# EAGLE design V2d_PCB (EAGLE 6.5.0)
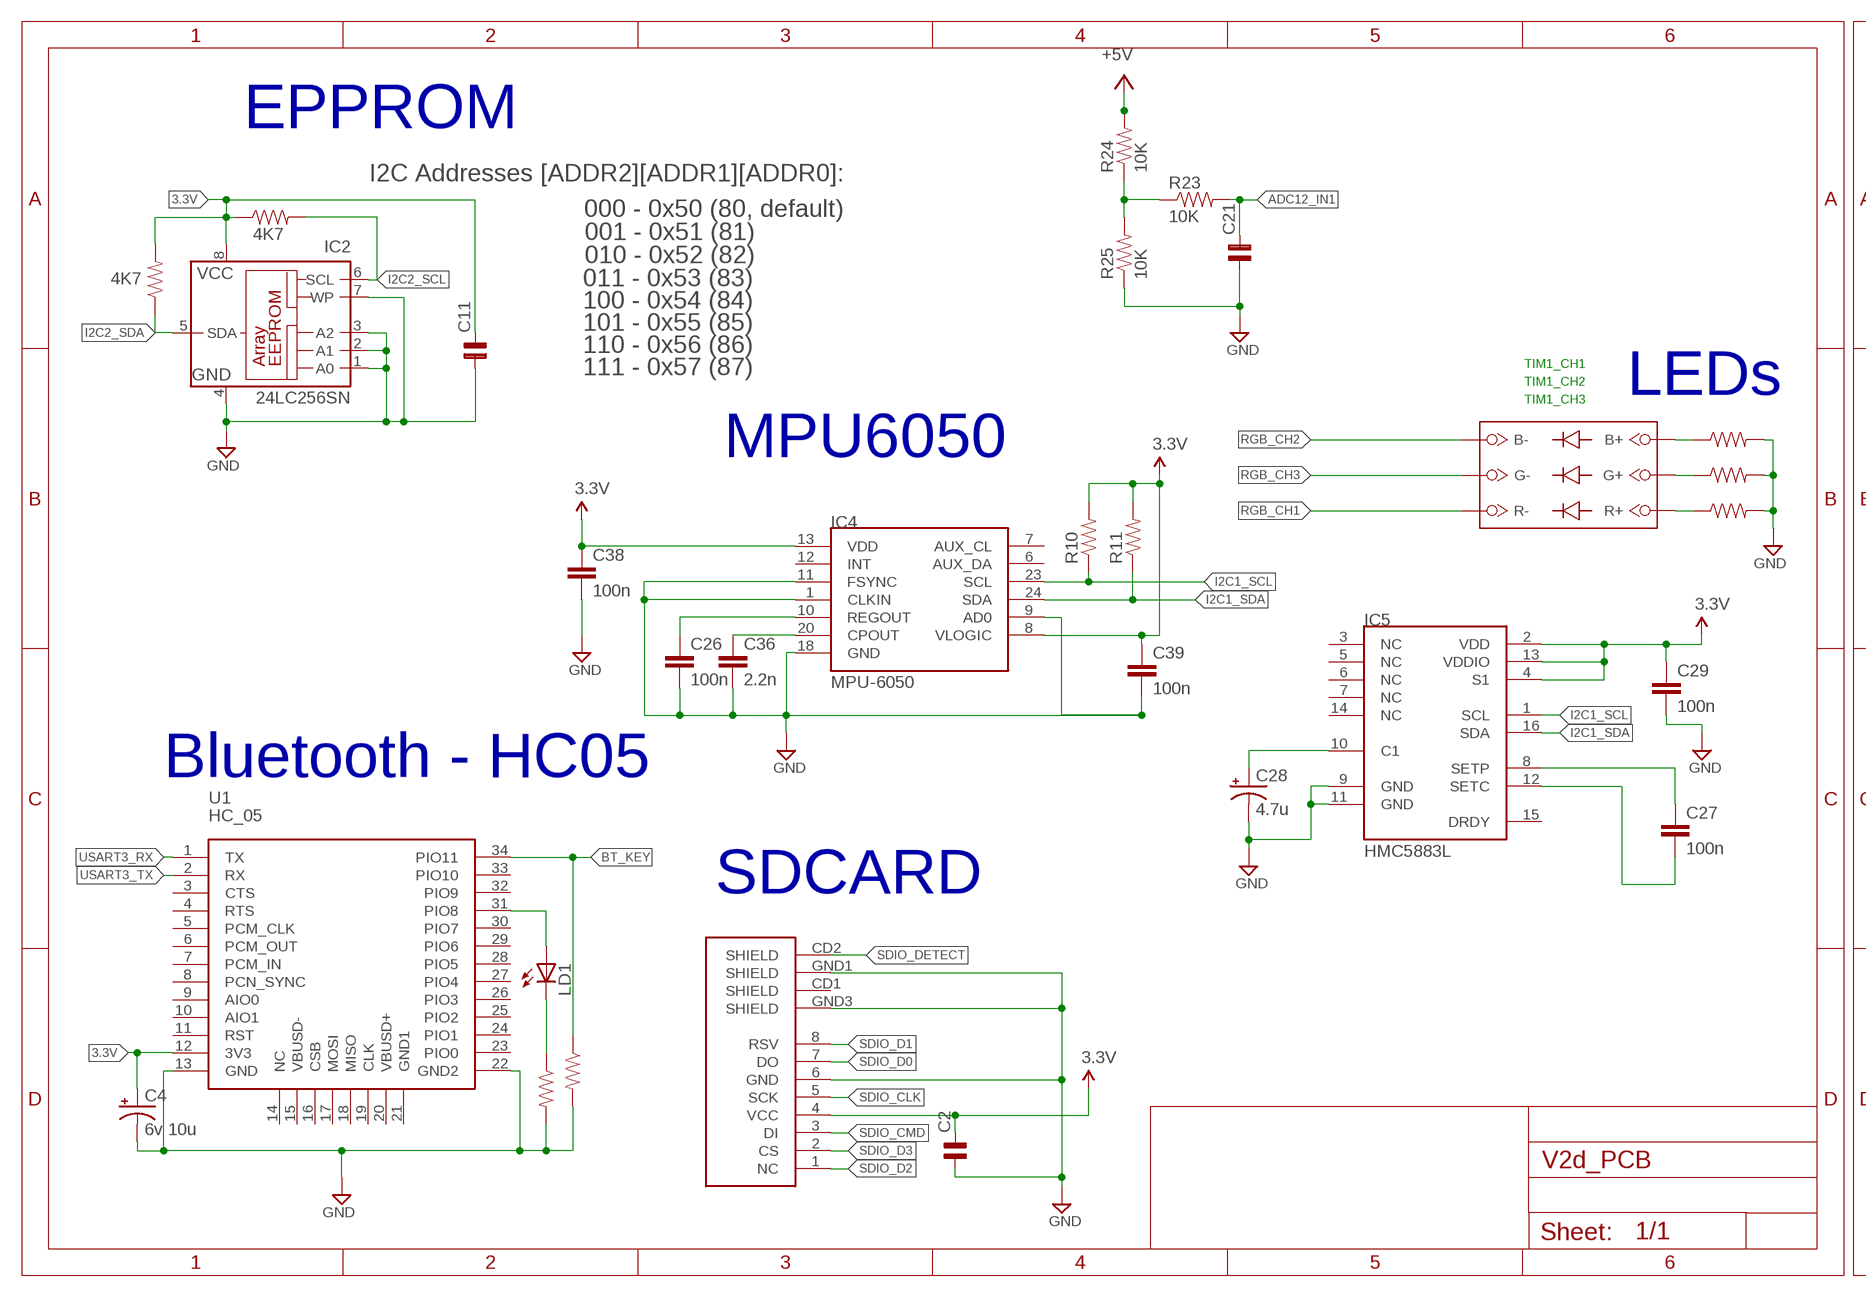
[diagram p0: schematic, sheet 1, part 1 of 2]
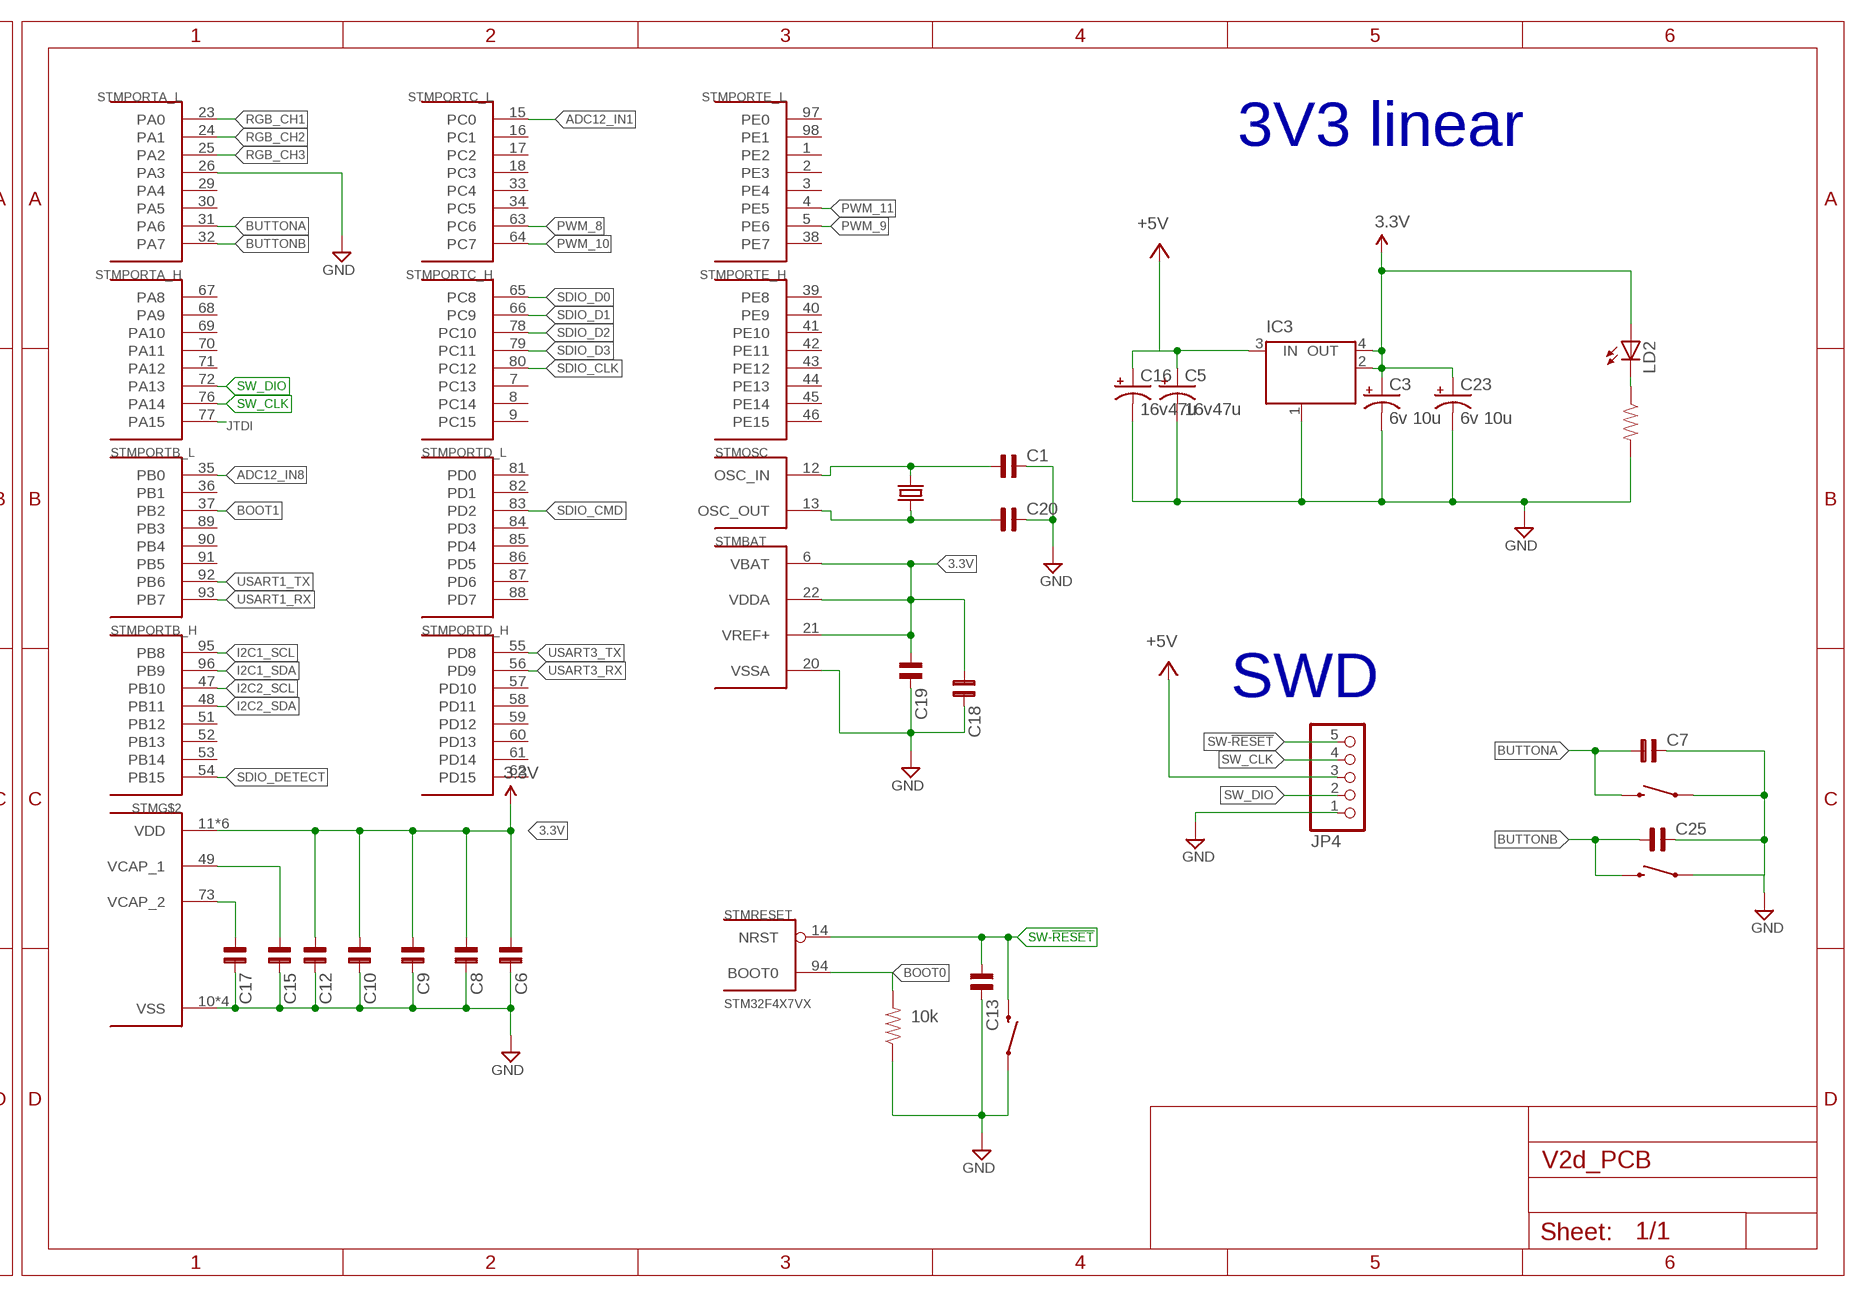
[diagram p1: schematic, sheet 1, part 2 of 2]

## Parts
C1  C-NP-SMD-0603  [C-0603]
C2  C-NP-SMD-0603  [C-0603]
C3  6v 10u  CPOL-USSMCC  [SMC_C]
C4  6v 10u  CPOL-USSMCA  [SMC_A]
C5  16v47u  CPOL-USSMCC  [SMC_C]
C6  C-NP-SMD-0603  [C-0603]
C7  C-NP-SMD-0603  [C-0603]
C8  C-NP-SMD-0603  [C-0603]
C9  C-NP-SMD-0603  [C-0603]
C10  C-NP-SMD-0603  [C-0603]
C11  C-NP-SMD-0603  [C-0603]
C12  C-NP-SMD-0603  [C-0603]
C13  C-NP-SMD-0603  [C-0603]
C15  C-NP-SMD-0603  [C-0603]
C16  16v47u  CPOL-USSMCC  [SMC_C]
C17  C-NP-SMD-0603  [C-0603]
C18  C-NP-SMD-0603  [C-0603]
C19  C-NP-SMD-0603  [C-0603]
C20  C-NP-SMD-0603  [C-0603]
C21  C-NP-SMD-0603  [C-0603]
C23  6v 10u  CPOL-USSMCC  [SMC_C]
C25  C-NP-SMD-0603  [C-0603]
C26  100n  SPARKFUN_CAP0603-CAP  [SPARKFUN_0603-CAP]
C27  100n  SPARKFUN_CAP0603-CAP  [SPARKFUN_0603-CAP]
C28  4.7u  CPOL-USSMCA  [SMC_A]
C29  100n  SPARKFUN_CAP0603-CAP  [SPARKFUN_0603-CAP]
C36  2.2n  SPARKFUN_CAP0603-CAP  [SPARKFUN_0603-CAP]
C38  100n  SPARKFUN_CAP0603-CAP  [SPARKFUN_0603-CAP]
C39  100n  SPARKFUN_CAP0603-CAP  [SPARKFUN_0603-CAP]
IC2  24LC256SN  [SO-08]
IC3  LINEAR_MC33269ST-3.3T3  [LINEAR_SOT223]
IC4  MPU-6050  TESTING_MPU-6050-1  [TESTING_QFN-24-4MM2]
IC5  HMC5883L  SPARKFUN_HMC5883LSMD  [SPARKFUN_16LPCC]
JP4  PINHD-1X5_2.54-90°  [1X05/90]
LD1  LEDCHIPLED_0603  [CHIPLED_0603]
LD2  LEDCHIPLED_0603  [CHIPLED_0603]
R1  10K  SPARKFUN_RESISTOR0603-RES  [SPARKFUN_0603-RES]
R2  10K  SPARKFUN_RESISTOR0603-RES  [SPARKFUN_0603-RES]
R3  10K  SPARKFUN_RESISTOR0603-RES  [SPARKFUN_0603-RES]
R5  10K  SPARKFUN_RESISTOR0603-RES  [SPARKFUN_0603-RES]
R6  10K  SPARKFUN_RESISTOR0603-RES  [SPARKFUN_0603-RES]
R7  10k  SPARKFUN_RESISTOR0603-RES  [SPARKFUN_0603-RES]
R9  10K  SPARKFUN_RESISTOR0603-RES  [SPARKFUN_0603-RES]
R10  SPARKFUN_RESISTOR0603-RES  [SPARKFUN_0603-RES]
R11  SPARKFUN_RESISTOR0603-RES  [SPARKFUN_0603-RES]
R15  4K7  SPARKFUN_RESISTOR0603-RES  [SPARKFUN_0603-RES]
R16  4K7  SPARKFUN_RESISTOR0603-RES  [SPARKFUN_0603-RES]
R23  10K  SPARKFUN_RESISTOR0603-RES  [SPARKFUN_0603-RES]
R24  10K  SPARKFUN_RESISTOR0603-RES  [SPARKFUN_0603-RES]
R25  10K  SPARKFUN_RESISTOR0603-RES  [SPARKFUN_0603-RES]
S1  RESET  SWITCH-MOMENTARY-2-SMD-1101NE  [TACTILE-SWITCH-1101NE]
S2  RESET  SWITCH-MOMENTARY-2-SMD-1101NE  [TACTILE-SWITCH-1101NE]
S4  RESET  SWITCH-MOMENTARY-2-SMD-1101NE  [TACTILE-SWITCH-1101NE]
SDCARD2  microSD Socket  USD-SOCKETNEW  [MICRO-SD-SOCKET-PP]
STM  STM32F4X7VX  [TQFP100]
U1  HC_05  [BLUETOOTH_SMD]
U$12  RGB_LED  [SMD]
Y1  CRYSTALHC49US  [HC49US]

## Nets
3.3V: C2.2 C3.+ C4.+ C6.1 C8.1 C9.1 C10.1 C11.2 C12.1 C18.1 C19.1 C23.+ C29.1 C38.1 C39.1 IC2.8(VCC) IC3.2(OUT) IC3.4(OUT) IC4.8(VLOGIC) IC4.13(VDD) IC5.2(VDD) IC5.4(S1) IC5.13(VDDIO) LD2.A R10.2 R11.2 R15.1 R16.2 SDCARD2.4(VCC) STM.6(BAT:VBAT) STM.11(VDD) STM.19(VDD) STM.21(BAT:VREF+) STM.22(BAT:VDDA) STM.28(VDD) STM.50(VDD) STM.75(VDD) STM.100(VDD) U1.12(3V3)
+5V: C5.+ C16.+ IC3.3(IN) JP4.3 R24.2
ADC12_IN1: C21.2 R23.2 STM.15(PORTC_L:PC0)
ADC12_IN8: STM.35(PORTB_L:PB0)
BOOT0: R7.2 STM.94(RESET:BOOT0)
BOOT1: STM.37(PORTB_L:PB2)
BT_KEY: R5.1 U1.34(PIO11)
BUTTONA: C7.1 S4.P$2 STM.31(PORTA_L:PA6)
BUTTONB: C25.1 S2.P$2 STM.32(PORTA_L:PA7)
GND: C1.2 C2.1 C3.- C4.- C5.- C6.2 C7.2 C8.2 C9.2 C10.2 C11.1 C12.2 C13.2 C15.2 C16.- C17.2 C18.2 C19.2 C20.2 C21.1 C23.- C25.2 C26.2 C28.- C29.2 C36.2 C38.2 C39.2 IC2.1(A0) IC2.2(A1) IC2.3(A2) IC2.4(GND) IC2.7(WP) IC3.1(GND/ADJ) IC4.1(CLKIN) IC4.9(AD0) IC4.11(FSYNC) IC4.18(GND) IC5.9(GND) IC5.11(GND) JP4.1 R1.2 R2.2 R3.2 R5.2 R6.2 R7.1 R9.2 R25.1 S1.P$1 S2.P$1 S4.P$1 SDCARD2.6(GND) SDCARD2.GND1(SHIELD) SDCARD2.GND3(SHIELD) STM.10(VSS) STM.20(BAT:VSSA) STM.26(PORTA_L:PA3) STM.27(VSS) STM.74(VSS) STM.99(VSS) U1.13(GND) U1.22(GND2)
I2C1_SCL: IC4.23(SCL) IC5.1(SCL) R10.1 STM.95(PORTB_H:PB8)
I2C1_SDA: IC4.24(SDA) IC5.16(SDA) R11.1 STM.96(PORTB_H:PB9)
I2C2_SCL: IC2.6(SCL) R15.2 STM.47(PORTB_H:PB10)
I2C2_SDA: IC2.5(SDA) R16.1 STM.48(PORTB_H:PB11)
JTDI: STM.77(PORTA_H:PA15)
N$1: C1.1 STM.12(OSC:OSC_IN) Y1.2
N$2: R2.1 U$12.B+
N$3: C26.1 IC4.10(REGOUT)
N$4: LD1.A U1.31(PIO8)
N$5: LD1.C R9.1
N$6: R6.1 U$12.R+
N$7: R3.1 U$12.G+
N$8: C36.1 IC4.20(CPOUT)
N$10: C27.1 IC5.8(SETP)
N$11: LD2.C R1.1
N$12: C28.+ IC5.10(C1)
N$13: C27.2 IC5.12(SETC)
N$27: R23.1 R24.1 R25.2
N$29: C20.1 STM.13(OSC:OSC_OUT) Y1.1
N$31: C17.1 STM.73(VCAP_2)
N$32: C15.1 STM.49(VCAP_1)
PWM_8: STM.63(PORTC_L:PC6)
PWM_9: STM.5(PORTE_L:PE6)
PWM_10: STM.64(PORTC_L:PC7)
PWM_11: STM.4(PORTE_L:PE5)
RGB_CH1: STM.23(PORTA_L:PA0) U$12.R-
RGB_CH2: STM.24(PORTA_L:PA1) U$12.B-
RGB_CH3: STM.25(PORTA_L:PA2) U$12.G-
SDIO_CLK: SDCARD2.5(SCK) STM.80(PORTC_H:PC12)
SDIO_CMD: SDCARD2.3(DI) STM.83(PORTD_L:PD2)
SDIO_D0: SDCARD2.7(DO) STM.65(PORTC_H:PC8)
SDIO_D1: SDCARD2.8(RSV) STM.66(PORTC_H:PC9)
SDIO_D2: SDCARD2.1(NC) STM.78(PORTC_H:PC10)
SDIO_D3: SDCARD2.2(CS) STM.79(PORTC_H:PC11)
SDIO_DETECT: SDCARD2.CD2(SHIELD) STM.54(PORTB_H:PB15)
SW-!RESET: C13.1 JP4.5 S1.P$2 STM.14(RESET:NRST)
SW_CLK: JP4.4 STM.76(PORTA_H:PA14)
SW_DIO: JP4.2 STM.72(PORTA_H:PA13)
USART1_RX: STM.93(PORTB_L:PB7)
USART1_TX: STM.92(PORTB_L:PB6)
USART3_RX: STM.56(PORTD_H:PD9) U1.1(TX)
USART3_TX: STM.55(PORTD_H:PD8) U1.2(RX)
Unconnected: IC4.6(AUX_DA) IC4.7(AUX_CL) IC4.12(INT) IC5.3(NC) IC5.5(NC) IC5.6(NC) IC5.7(NC) IC5.14(NC) IC5.15(DRDY) SDCARD2.CD1(SHIELD) STM.1(PORTE_L:PE2) STM.2(PORTE_L:PE3) STM.3(PORTE_L:PE4) STM.7(PORTC_H:PC13) STM.8(PORTC_H:PC14) STM.9(PORTC_H:PC15) STM.16(PORTC_L:PC1) STM.17(PORTC_L:PC2) STM.18(PORTC_L:PC3) STM.29(PORTA_L:PA4) STM.30(PORTA_L:PA5) STM.33(PORTC_L:PC4) STM.34(PORTC_L:PC5) STM.36(PORTB_L:PB1) STM.38(PORTE_L:PE7) STM.39(PORTE_H:PE8) STM.40(PORTE_H:PE9) STM.41(PORTE_H:PE10) STM.42(PORTE_H:PE11) STM.43(PORTE_H:PE12) STM.44(PORTE_H:PE13) STM.45(PORTE_H:PE14) STM.46(PORTE_H:PE15) STM.51(PORTB_H:PB12) STM.52(PORTB_H:PB13) STM.53(PORTB_H:PB14) STM.57(PORTD_H:PD10) STM.58(PORTD_H:PD11) STM.59(PORTD_H:PD12) STM.60(PORTD_H:PD13) STM.61(PORTD_H:PD14) STM.62(PORTD_H:PD15) STM.67(PORTA_H:PA8) STM.68(PORTA_H:PA9) STM.69(PORTA_H:PA10) STM.70(PORTA_H:PA11) STM.71(PORTA_H:PA12) STM.81(PORTD_L:PD0) STM.82(PORTD_L:PD1) STM.84(PORTD_L:PD3) STM.85(PORTD_L:PD4) STM.86(PORTD_L:PD5) STM.87(PORTD_L:PD6) STM.88(PORTD_L:PD7) STM.89(PORTB_L:PB3) STM.90(PORTB_L:PB4) STM.91(PORTB_L:PB5) STM.97(PORTE_L:PE0) STM.98(PORTE_L:PE1) U1.3(CTS) U1.4(RTS) U1.5(PCM_CLK) U1.6(PCM_OUT) U1.7(PCM_IN) U1.8(PCN_SYNC) U1.9(AIO0) U1.10(AIO1) U1.11(RST) U1.14(NC) U1.15(VBUSD-) U1.16(CSB) U1.17(MOSI) U1.18(MISO) U1.19(CLK) U1.20(VBUSD+) U1.21(GND1) U1.23(PIO0) U1.24(PIO1) U1.25(PIO2) U1.26(PIO3) U1.27(PIO4) U1.28(PIO5) U1.29(PIO6) U1.30(PIO7) U1.32(PIO9) U1.33(PIO10)

## Notes on the sheet
- EPPROM | 3V3 linear
- I2C Addresses [ADDR2][ADDR1][ADDR0]:
- 000 - 0x50 (80, default)
- 001 - 0x51 (81)
- 010 - 0x52 (82)
- 011 - 0x53 (83)
- 100 - 0x54 (84)
- 101 - 0x55 (85)
- 110 - 0x56 (86)
- TIM1_CH1
- 111 - 0x57 (87)
- TIM1_CH2
- LEDs
- TIM1_CH3
- MPU6050
- SWD
- Bluetooth - HC05
- SDCARD
- TJA1040

## Library data of the parts
C1 C2 C6-C13 C15 C17-C21 C25 = cap-pan40:C-NP: NON-POLARIZED FILM/CHIP
C3-C5 C16 C23 C28 = rcl:CPOL-US: POLARIZED CAPACITOR, American symbol
C26 C27 C29 C36 C38 C39 = Helios_RLC:SPARKFUN_CAP: Capacitor Standard 0603 ceramic capacitor, and 0.1" leaded capacitor.
IC2 = microchip:24*: Serial EEPROM I2C; DIGIKEY: 24LC256-E/SN-ND; MF: MICROCHIP; MPN: 24LC256-I/SN; OC_FARNELL: 9757996; OC_NEWARK: 27C9144
IC3 = Robotech_Other:LINEAR_MC33269ST*: Adjustable Output Low Dropout Voltage Regulator 800 mA Source: http://www.onsemi.com/pub/Collateral/MC33269-D.PDF
IC4 = Helios_IMU:TESTING_MPU-6050
IC5 = Helios_IMU:SPARKFUN_HMC5883L: 3 Axis Digital Compass IC
JP4 = pinhead-1:PINHD-1X5: PIN HEADER
LD1 LD2 = led:LED: LED OSRAM: - CHIPLED LG R971, LG N971, LY N971, LG Q971, LY Q971, LO R971, LY R971 LH N974, LH R974 LS Q976, LO Q976, LY Q976 LO Q996 - Hyper CHIPLED LW Q18S LB Q993, LB Q99A, LB R99A - SideLED LS A670, LO A670, LY A670, LG A670, LP A670 LB A673, LV A673, LT A673, LW A673 LH A674 LY A675 LS A676, LA A676, LO A676, LY A676, LW A676 LS A679, LY A679, LG A679 - Hyper Micro SIDELED® LS Y876, LA Y876, LO Y876, LY Y876 LT Y87S - SmartLED LW L88C, LW L88S LB L89C, LB L89S, LG L890 LS L89K, LO L89K, LY L89K LS L896, LA L896, LO L896, LY L896 - TOPLED LS T670, LO T670, LY T670, LG T670, LP T670 LSG T670, LSP T670, LSY T670, LOP T670, LYG T670 LG T671, LOG T671, LSG T671 LB T673, LV T673, LT T673, LW T673 LH T674 LS T676, LA T676, LO T676, LY T676, LB T676, LH T676, LSB T676, LW T676 LB T67C, LV T67C, LT T67C, LS T67K, LO T67K, LY T67K, LW E67C LS E67B, LA E67B, LO E67B, LY E67B, LB E67C, LV E67C, LT E67C LW T67C LS T679, LY T679, LG T679 LS T770, LO T770, LY T770, LG T770, LP T770 LB T773, LV T773, LT T773, LW T773 LH T774 LS E675, LA E675, LY E675, LS T675 LS T776, LA T776, LO T776, LY T776, LB T776 LHGB T686 LT T68C, LB T68C - Hyper Mini TOPLED® LB M676 - Mini TOPLED Santana® LG M470 LS M47K, LO M47K, LY M47K Source: http://www.osram.convergy.de/
R1-R3 R5-R7 R9 R15 R16 R23-R25 = Robotech_RCL:SPARKFUN_RESISTOR: Resistor Basic schematic elements and footprints for 0603, 1206, and PTH resistors.
R10 R11 = Helios_RLC:SPARKFUN_RESISTOR: Resistor Basic schematic elements and footprints for 0603, 1206, and PTH resistors.
S1 S2 S4 = pixhawk2:SWITCH-MOMENTARY-2; PARTNO: EVQ-P7J01P
SDCARD2 = SparkFun:USD-SOCKET: microSD Socket Push-push type uSD socket. Schematic element and footprint production proven. Spark Fun Electronics SKU : PRT-00127. tDoc lines correctly indicate media card edge positions when inserting (unlocked, locked, depressed).
STM = pixhawk2:STM32F4X7VX: STM32F4X7VX 100 pin LQFP STM32F407VE - 512 KB flash, no crypto STM32F407VG - 1 MB flash, no crypto STM32F417VE - 512 KB flash, with crypto STM32F417VG - 1 MB flash, with crypto; PARTNO: STM32F427VI
U1 = SerialPortBluetooth:HC_05
U$12 = RGB_LED:RGB_LED
Y1 = SparkFun-FreqCtrl:CRYSTAL: Various standard crystals. Proven footprints. Spark Fun Electronics SKU : COM-00534

## Net classes
1 power: width 0.15 mm, drill 0.2 mm, clearance 0.152 mm

## Board
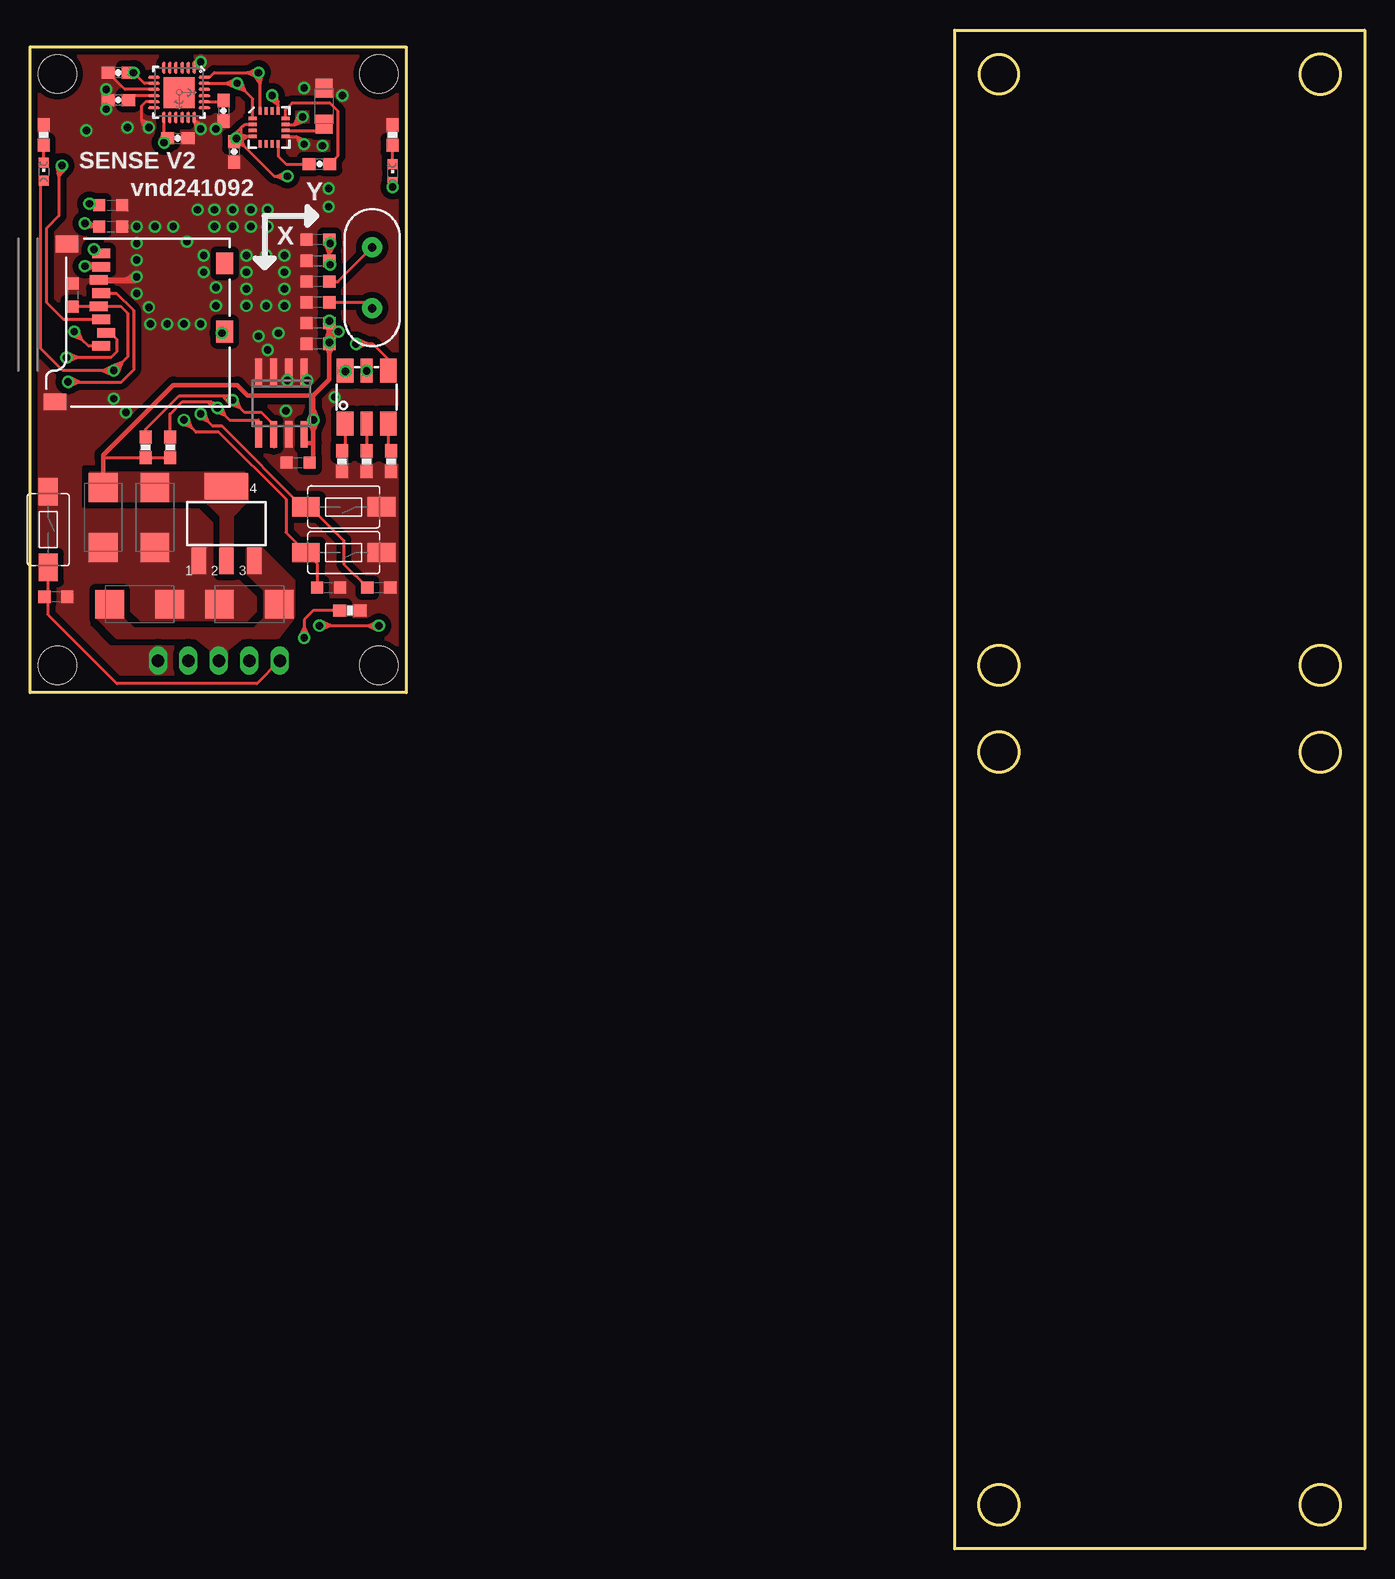
[diagram p2: board, top side]
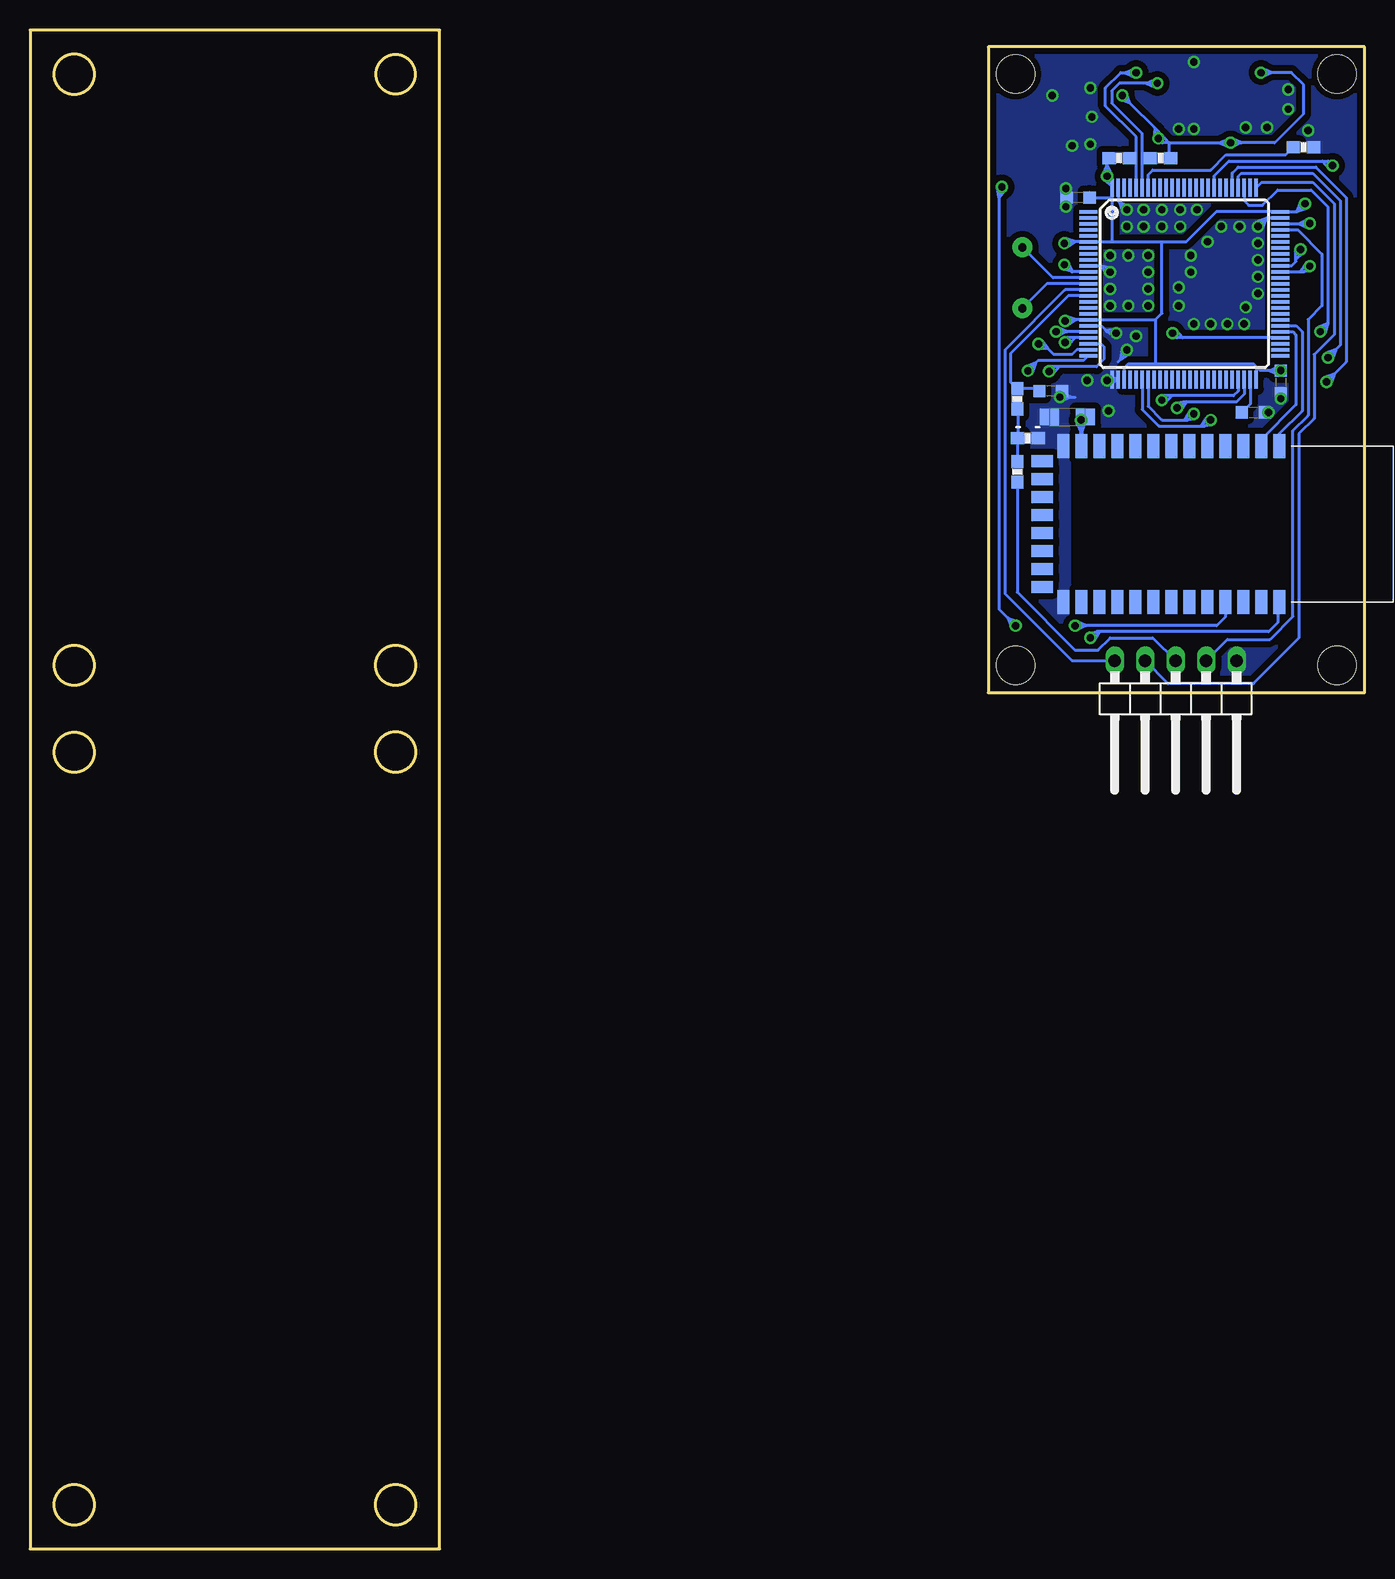
[diagram p3: board, bottom side, seen from below]

Size 111.25 x 126.62 mm. Coordinates in mm from the lower left corner, seen from the top.
Outline: 31.37,71.37 0,71.37 0,125.22 31.37,125.22 31.37,71.37
Outline: 111.25,126.62 111.25,0 77.09,0 77.09,126.62 111.25,126.62
Outline: circle at 80.77,122.94 radius 1.63
Outline: circle at 107.57,122.94 radius 1.65
Outline: circle at 107.57,73.66 radius 1.66
Outline: circle at 107.57,66.42 radius 1.65
Outline: circle at 80.77,73.66 radius 1.65
Outline: circle at 80.77,66.42 radius 1.66
Outline: circle at 107.57,3.68 radius 1.65
Outline: circle at 80.77,3.68 radius 1.66
Copper layers (1*16): Top 0.035mm / dielectric 1.5mm / Bottom 0.035mm
Design rules "default *": minimum track width 10mil, minimum drill 24mil, track to track 8mil, track to pad 8mil, pad to pad 8mil, via to via 10mil, smd to smd 8mil, copper to edge 20mil, drill to drill 10mil, minimum pad ring 10mil, minimum via ring 8mil, stop-mask expansion 0mil, vias tented up to drill 100mil, thermal gap 10mil
Holes 3.2 mm at 29.08,73.66 2.29,73.66 2.29,122.94 29.08,122.94
tKeepout: area 15.2,64.8 to 22.2,71.8

### Footprints (pad centres in the part's own frame; a part is rotated, then mirrored left to right if it is on the bottom)
C-0603 = smd 1.016 x 1.016: 1 -0.953,0; 2 0.953,0
SMC_C = smd 2.4 x 2.4: + -2.5,0; - 2.5,0
SMC_A = smd 1.6 x 1.4: + -1.5,0; - 1.5,0
SPARKFUN_0603-CAP = smd 1.1 x 1: 1 -0.85,0; 2 0.85,0
SO-08 = smd 0.6 x 2.2: 1 -1.905,-2.6; 2 -0.635,-2.6; 3 0.635,-2.6; 4 1.905,-2.6; 5 1.905,2.6; 6 0.635,2.6; 7 -0.635,2.6; 8 -1.905,2.6
LINEAR_SOT223 = smd 1.219 x 2.235: 1 -2.311,-3.099; 2 0,-3.099; 3 2.311,-3.099 | smd 3.6 x 2.2: 4 0,3.099
TESTING_QFN-24-4MM2 = smd 1.016 x 0.254: 1 -2.066,1.257; 2 -2.066,0.75; 3 -2.066,0.247; 4 -2.066,-0.287; 5 -2.066,-0.792; 6 -2.066,-1.297; 13 2.086,-1.297; 14 2.086,-0.792; 15 2.086,-0.287; 16 2.086,0.247; 17 2.086,0.75; 18 2.086,1.257 | smd 0.254 x 1.016: 7 -1.267,-2.122; 8 -0.762,-2.122; 9 -0.258,-2.122; 10 0.278,-2.122; 11 0.78,-2.122; 12 1.287,-2.122; 19 1.287,2.082; 20 0.78,2.082; 21 0.278,2.082; 22 -0.258,2.082; 23 -0.762,2.082; 24 -1.267,2.082 | smd 2.616 x 2.616: P$1 0.02,-0.01
SPARKFUN_16LPCC = smd 0.65 x 0.28: 1 -1.37,0.75; 2 -1.37,0.25; 3 -1.37,-0.25; 4 -1.37,-0.75; 9 1.37,-0.75; 10 1.37,-0.25; 11 1.37,0.25; 12 1.37,0.75 | smd 0.28 x 0.65: 5 -0.75,-1.37; 6 -0.25,-1.37; 7 0.25,-1.37; 8 0.75,-1.37; 13 0.75,1.37; 14 0.25,1.37; 15 -0.25,1.37; 16 -0.75,1.37
1X05/90 = drill 1.016 long: 1 -5.08,-3.81; 2 -2.54,-3.81; 3 0,-3.81; 4 2.54,-3.81; 5 5.08,-3.81
CHIPLED_0603 = smd 0.8 x 0.8: A 0,-0.75; C 0,0.75
SPARKFUN_0603-RES = smd 1.1 x 1: 1 -0.85,0; 2 0.85,0
TACTILE-SWITCH-1101NE = smd 2.3 x 1.6: P$1 -3.15,0; P$2 3.15,0
MICRO-SD-SOCKET-PP = smd 0.8 x 1.5: 1 -8.94,10.7; 2 -7.84,10.3; 3 -6.74,10.7; 4 -5.64,10.9; 5 -4.54,10.7; 6 -3.44,10.9; 7 -2.34,10.7; 8 -1.24,10.7 | smd 1.8 x 1.4: CD1 -2.05,0.4; CD2 -7.75,0.4 | smd 1.4 x 1.9: GND1 -13.6,14.55; GND3 -0.45,13.55
TQFP100 = smd 1.5 x 0.29: 1 -8,6; 2 -8,5.5; 3 -8,5; 4 -8,4.5; 5 -8,4; 6 -8,3.5; 7 -8,3; 8 -8,2.5; 9 -8,2; 10 -8,1.5; 11 -8,1; 12 -8,0.5; 13 -8,0; 14 -8,-0.5; 15 -8,-1; 16 -8,-1.5; 17 -8,-2; 18 -8,-2.5; 19 -8,-3; 20 -8,-3.5; 21 -8,-4; 22 -8,-4.5; 23 -8,-5; 24 -8,-5.5; 25 -8,-6; 51 8,-6; 52 8,-5.5; 53 8,-5; 54 8,-4.5; 55 8,-4; 56 8,-3.5; 57 8,-3; 58 8,-2.5; 59 8,-2; 60 8,-1.5; 61 8,-1; 62 8,-0.5; 63 8,0; 64 8,0.5; 65 8,1; 66 8,1.5; 67 8,2; 68 8,2.5; 69 8,3; 70 8,3.5; 71 8,4; 72 8,4.5; 73 8,5; 74 8,5.5; 75 8,6 | smd 0.29 x 1.5: 26 -6,-8; 27 -5.5,-8; 28 -5,-8; 29 -4.5,-8; 30 -4,-8; 31 -3.5,-8; 32 -3,-8; 33 -2.5,-8; 34 -2,-8; 35 -1.5,-8; 36 -1,-8; 37 -0.5,-8; 38 0,-8; 39 0.5,-8; 40 1,-8; 41 1.5,-8; 42 2,-8; 43 2.5,-8; 44 3,-8; 45 3.5,-8; 46 4,-8; 47 4.5,-8; 48 5,-8; 49 5.5,-8; 50 6,-8; 76 6,8; 77 5.5,8; 78 5,8; 79 4.5,8; 80 4,8; 81 3.5,8; 82 3,8; 83 2.5,8; 84 2,8; 85 1.5,8; 86 1,8; 87 0.5,8; 88 0,8; 89 -0.5,8; 90 -1,8; 91 -1.5,8; 92 -2,8; 93 -2.5,8; 94 -3,8; 95 -3.5,8; 96 -4,8; 97 -4.5,8; 98 -5,8; 99 -5.5,8; 100 -6,8
BLUETOOTH_SMD = smd 2 x 1: 1 0,0; 2 0,-1.5; 3 0,-3; 4 0,-4.5; 5 0,-6; 6 0,-7.5; 7 0,-9; 8 0,-10.5; 9 0,-12; 10 0,-13.5; 11 0,-15; 12 0,-16.5; 13 0,-18; 22 13,-18; 23 13,-16.5; 24 13,-15; 25 13,-13.5; 26 13,-12; 27 13,-10.5; 28 13,-9; 29 13,-7.5; 30 13,-6; 31 13,-4.5; 32 13,-3; 33 13,-1.5; 34 13,0 | smd 1 x 1.8: 14 1.25,-19.75; 15 2.75,-19.75; 16 4.25,-19.75; 17 5.75,-19.75; 18 7.25,-19.75; 19 8.75,-19.75; 20 10.25,-19.75; 21 11.75,-19.75
SMD = smd 1.99 x 1.4: B+ -2.2,-1.8; B- 2.2,-1.8; R+ -2.2,1.8; R- 2.2,1.8 | smd 1.99 x 1: G+ -2.2,0; G- 2.2,0
HC49US = drill 0.7 pad 1.651: 1 -2.54,0; 2 2.54,0

### Placement (x,y rotation side)
C1  24,105.64 180 top
C2  3.56,104.52 270 top
C3  10.41,85.98 270 top
C4  24.77,94.36 180 bottom
C5  18.29,78.74 180 top
C6  24,100.46 180 top
C7  24.89,80.14 0 top
C8  24,102.18 180 top
C9  24,107.37 180 top
C10  24,109.14 180 top
C11  22.35,90.55 0 top
C12  23.88,112.65 180 bottom
C13  2.16,79.38 0 top
C15  9.27,94.74 0 bottom
C16  9.14,78.74 0 top
C17  6.73,110.24 0 top
C18  6.99,97.28 270 bottom
C19  6.73,112.01 0 top
C20  24,103.91 180 top
C21  26.16,96.52 180 bottom
C23  6.1,85.98 270 top
C25  29.08,80.14 0 top
C26  7.37,120.78 180 top
C27  24.13,115.44 0 top
C28  24.51,120.27 90 top
C29  17.02,116.46 270 top
C36  16.13,119.89 270 top
C38  12.32,117.6 0 top
C39  7.37,123.06 180 top
IC2  20.96,95.5 180 top
IC3  16.38,85.47 0 top
IC4  12.45,121.41 270 top
IC5  19.94,118.49 0 top
JP4  15.75,70.23 180 bottom
LD1  30.23,114.68 0 top
LD2  1.14,114.81 0 top
R1  1.14,117.86 90 top
R2  30.1,90.68 270 top
R3  28.07,90.68 270 top
R5  26.67,78.23 0 top
R6  26.04,90.68 270 top
R7  5.08,116.84 180 bottom
R9  30.23,117.86 90 top
R10  17.02,115.95 0 bottom
R11  20.45,115.95 180 bottom
R15  9.65,91.82 90 top
R16  11.68,91.82 270 top
R23  28.96,95.89 90 bottom
R24  28.96,89.79 270 bottom
R25  28.07,92.58 180 bottom
S1  1.52,84.96 270 top
S2  26.16,86.87 180 top
S4  26.16,83.06 180 top
SDCARD2  16.64,109.22 90 top
STM  15.04,105.46 0 bottom
U1  7.11,91.95 270 bottom
U$12  28.07,96.01 90 top
Y1  28.52,105.97 90 top

### Tracks (layer width: path | path; a pad name or v marks a point on that pad's centre or on a via)
3.3V  (via drill 0.61)
  Top 0.254: IC5.13 20.69,120.39 | 20.69,120.39 20.69,120.66 v20.19,121.16 | v8.64,123.06 C39.1 | IC4.8 9.52,122.17 9.28,122.42 | 9.28,122.42 | 9.28,122.42 v8.64,123.06 | IC5.2 17.9,118.74 17.58,118.42 | v11.18,117.22 11.18,117.35 | 9.28,122.42 | 9.28,122.42 | v25.02,107.06 25.02,107.3 C9.1 24.96,107.93 | v25.02,108.84 25.02,109.08 C10.1 | 24.96,107.93 24.96,107.97 | 24.96,107.97 24.96,108.78 v25.02,108.84 | v24.96,102.36 C8.1 | 7.63,98.88 8.13,99.38 8.13,103 7.54,103.58 SDCARD2.4 3.57,103.58 C2.2 | 7.63,98.88 C18.1 | C18.1 6.07,98.23 | 6.07,98.23 2.73,98.23 0.89,100.08 0.89,113.8 LD2.A | R16.2 R15.1 9.61,90.93 6.1,90.93 | IC4.13 11.15,118.13 | 11.15,118.13 11.15,117.25 v11.18,117.22 | C38.1 11.47,117.51 v11.18,117.22 | v17.2,117.59 17.84,116.94 | 17.84,116.94 20.36,114.43 20.55,114.43 | 17.58,118.42 17.02,117.86 C29.1 17.02,117.41 v17.2,117.59 | IC5.4 18.1,117.74 | 18.1,117.74 17.35,117.74 v17.2,117.59 | 20.55,114.43 v21.46,114.43 | C19.1 5.08,112.01 v4.95,112.14 | 20.69,120.39 19.99,120.84 v20.19,121.16 | 20.69,120.39 20.57,121.21 v20.19,121.16 | 17.84,116.94 17.07,117.23 v17.2,117.59 | 17.84,116.94 17.55,117.72 v17.2,117.59 | 17.58,118.42 17.58,117.59 v17.2,117.59 | 17.58,118.42 16.95,117.88 v17.2,117.59 | 18.1,117.74 17.41,117.27 v17.2,117.59 | 18.1,117.74 17.3,117.95 v17.2,117.59 | v8.64,123.06 8.35,123.32 7.8,122.7 8.63,122.68 v8.64,123.06 | 20.55,114.43 21.3,114.77 v21.46,114.43 | 20.55,114.43 21.3,114.08 v21.46,114.43 | 11.15,118.13 11.52,117.39 v11.18,117.22 | 11.15,118.13 10.82,117.37 v11.18,117.22 | 24.96,107.97 25.35,107.24 v25.02,107.06 | 24.96,107.97 24.66,107.19 v25.02,107.06 | 24.96,107.93 24.66,108.7 v25.02,108.84
  Top 0.254: 24.96,107.93 25.35,108.66 v25.02,108.84 | 7.63,98.88 7.34,98.1 C18.1 | 7.63,98.88 6.85,98.59 C18.1 | 6.07,98.23 6.83,98.58 C18.1 | 6.07,98.23 6.83,97.89 C18.1
  Top 0.381: 23.62,96.14 18.16,96.14 17.27,97.03 11.94,97.03 6.1,91.19 6.1,90.93 C23.+ | 23.62,96.14 23.62,95.02 | 23.62,95.02 v23.62,94.11 | C11.2 23.62,90.55 23.62,92.2 | 23.62,92.2 23.62,93.19 | 23.62,93.19 v23.62,94.11 | 23.62,92.2 22.86,92.2 IC2.8 | v24.96,100.58 C6.1 24.96,99.67 | C8.1 24.96,101.98 | 24.96,101.98 24.96,101.5 | 24.96,101.5 24.96,101.47 | v25.72,101.47 25.17,101.47 | 25.17,101.47 24.96,101.47 | 24.96,101.47 24.96,101.45 | 24.96,101.45 24.96,100.97 | 24.96,100.97 v24.96,100.58 | 23.62,96.14 24.96,97.47 24.96,99.67 | 25.17,101.47 24.69,102.19 v24.96,102.36 | 25.17,101.47 25.27,102.33 v24.96,102.36 | 24.96,101.45 24.66,102.25 v24.96,102.36 | 24.96,101.45 25.25,102.25 v24.96,102.36 | 24.96,101.5 25.25,100.69 v24.96,100.58 | 24.96,101.5 24.66,100.69 v24.96,100.58 | 25.17,101.47 25.27,100.62 v24.96,100.58 | 25.17,101.47 24.69,100.76 v24.96,100.58 | 24.96,99.67 24.66,100.47 v24.96,100.58 | 24.96,99.67 25.25,100.47 v24.96,100.58 | 24.96,101.98 25.79,101.78 v25.72,101.47 | 24.96,101.98 25.46,101.29 v25.72,101.47 | 24.96,100.97 25.46,101.66 v25.72,101.47 | 24.96,100.97 25.79,101.16 v25.72,101.47 | 23.62,95.02 23.92,94.22 v23.62,94.11 | 23.62,95.02 23.32,94.22 v23.62,94.11 | 23.62,93.19 23.32,94 v23.62,94.11 | 23.62,93.19 23.92,94 v23.62,94.11
  Bottom 0.254: STM.100 21.09,113.41 | 21.04,108.96 21.04,112.78 | 21.04,112.78 STM.100 | 21.04,108.96 STM.6 24.11,108.96 | 21.04,112.78 21.17,112.65 C12.1 22.92,113.09 | 23.05,101.47 STM.21 24.8,101.46 | 21.17,115.82 21.59,115.82 21.46,115.69 21.46,115.34 | 16.26,117.22 16.26,116.04 R10.2 16.13,115.99 | STM.28 20.04,98.45 19.69,98.81 17.43,98.81 | 17.43,98.81 9.27,98.81 9.04,98.58 | 9.04,98.58 STM.50 | R11.2 21.17,115.82 | 21.17,115.82 21.04,115.82 | 21.46,115.34 | 21.46,115.34 | STM.11 24.33,106.46 | 24.33,106.46 24.42,106.46 v25.02,107.06 | 21.04,108.96 16.89,108.96 | 16.89,108.96 14.87,108.96 12.37,111.46 STM.75 5.64,111.46 5.6,111.49 | C18.1 7.9,98.23 | 7.9,98.23 8.7,98.23 9.04,98.58 | 24.11,108.96 24.9,108.96 v25.02,108.84 | 5.6,111.49 v4.95,112.14 | 24.8,101.46 25.7,101.46 v25.72,101.47 | 10.26,117.22 7.49,117.22 5.08,119.63 5.08,122.05 6.1,123.06 7.72,123.06 | 10.26,117.22 v11.18,117.22 | 16.26,117.22 12.09,117.22 | 12.09,117.22 v11.18,117.22 | 16.91,117.3 v17.2,117.59 | 21.46,115.34 v21.46,114.43 | v21.46,114.43 21.04,114 21.04,113.62 | 21.04,113.62 STM.100 | STM.22 24.12,100.96 | 24.12,100.96 24.58,100.96 v24.96,100.58 | 24.05,102.46 STM.19 17.43,102.46 | 24.05,102.46 24.86,102.46 v24.96,102.36 | v20.19,121.16 19.55,120.51 | 19.55,120.51 17.49,118.45 | 17.49,118.45 17.2,118.16 v17.2,117.59 | 7.72,123.06 v8.64,123.06 | 16.26,117.22 16.36,117.22 | 16.36,117.22 16.83,117.22 v17.2,117.59 | 16.89,108.96 16.89,103 17.43,102.46 | 17.43,102.46 17.43,98.81 | C4.+ 23.37,94.36 v23.62,94.11 | 19.55,120.51 19.84,121.29 v20.19,121.16 | 19.55,120.51 20.33,120.8 v20.19,121.16 | 17.49,118.45 17.58,117.63 v17.2,117.59 | 17.49,118.45 16.92,117.85 v17.2,117.59
  Bottom 0.254: 16.36,117.22 16.91,117.84 v17.2,117.59 | 16.36,117.22 17.19,117.2 v17.2,117.59 | 7.72,123.06 8.48,123.41 v8.64,123.06 | 7.72,123.06 8.48,122.72 v8.64,123.06 | 21.46,115.34 21.81,114.59 v21.46,114.43 | 21.46,115.34 21.12,114.59 v21.46,114.43 | 21.04,113.62 21.08,114.45 v21.46,114.43 | 21.04,113.62 21.7,114.13 v21.46,114.43 | 10.26,117.22 11.02,117.57 v11.18,117.22 | 10.26,117.22 11.02,116.88 v11.18,117.22 | 12.09,117.22 11.33,116.88 v11.18,117.22 | 12.09,117.22 11.33,117.57 v11.18,117.22 | 24.33,106.46 24.67,107.22 v25.02,107.06 | 24.33,106.46 25.13,106.7 v25.02,107.06 | 24.11,108.96 24.91,109.2 v25.02,108.84 | 24.11,108.96 24.82,108.52 v25.02,108.84 | 24.05,102.46 24.83,102.72 v24.96,102.36 | 24.05,102.46 24.76,102.03 v24.96,102.36 | 24.12,100.96 24.95,100.97 v24.96,100.58 | 24.12,100.96 24.67,100.33 v24.96,100.58 | 24.8,101.46 25.55,101.82 v25.72,101.47 | 24.8,101.46 25.57,101.12 v25.72,101.47 | 7.9,98.23 7.14,97.89 C18.1 | 7.9,98.23 7.14,98.58 C18.1 | 5.6,111.49 4.82,111.78 v4.95,112.14 | 5.6,111.49 5.31,112.27 v4.95,112.14
  Bottom 0.381: U1.12 23.62,93.19 | 23.62,93.19 v23.62,94.11 | 23.62,93.19 23.32,94 v23.62,94.11 | 23.62,93.19 23.92,94 v23.62,94.11
  other vias: 6.99,98.23
  pour Top (isolate 0.635, no thermals): 4.95,87.38 14.6,87.38 15.87,86.11 15.87,83.44 16.89,83.44 16.89,86.11 18.16,87.38 18.16,89.66 4.95,89.66
+5V
  Bottom 0.254: R24.2 28.96,79.76 24.13,74.93 22.23,74.93 21.21,75.95 17.65,75.95 JP4.3
  pour Top (isolate 0.635, no thermals): 15.11,74.04 15.11,74.93 13.84,75.95 7.24,75.95 5.59,77.6 7.75,77.6 8.64,76.71 18.67,76.71 19.56,77.6 19.56,79.88 18.16,81.28 18.16,83.44 19.3,83.44 21.97,80.77 21.97,77.6 20.7,75.95 17.65,75.95 16.38,74.93 16.38,74.04
ADC12_IN1
  Bottom 0.254: C21.2 arc-90 27.33,96.73 R23.2 29.46,97.24 29.46,99.69 24.7,104.46 STM.15
BOOT0
  Bottom 0.254: STM.94 18.04,114.55 17.65,114.94 12.83,114.94 11.56,116.2 6.57,116.2 R7.2
BT_KEY  (via drill 0.61)
  Top 0.254: R5.1 23.62,78.23 22.86,77.47 22.86,76.86 | 22.86,76.86 v22.86,75.95 | 22.86,76.86 23.21,76.11 v22.86,75.95 | 22.86,76.86 22.51,76.11 v22.86,75.95
  Bottom 0.254: U1.34 7.24,78.82 7.24,77.22 8,76.45 22.1,76.45 | 22.1,76.45 22.35,76.45 v22.86,75.95 | 22.1,76.45 22.92,76.32 v22.86,75.95 | 22.1,76.45 22.54,75.75 v22.86,75.95
BUTTONA  (via drill 0.61)
  Top 0.254: v12.83,94.11 13.47,93.46 | 13.47,93.46 13.84,93.09 15.75,93.09 21.34,87.5 21.34,84.73 S4.P$2 | 22.61,83.06 S4.P$2 | S4.P$2 23.94,82.13 C7.1 | 13.47,93.46 12.69,93.75 v12.83,94.11 | 13.47,93.46 13.18,94.24 v12.83,94.11
  Bottom 0.254: STM.31 18.54,94.99 17.14,93.6 13.59,93.6 | 13.59,93.6 13.33,93.6 v12.83,94.11 | 13.59,93.6 12.77,93.73 v12.83,94.11 | 13.59,93.6 13.15,94.31 v12.83,94.11
BUTTONB  (via drill 0.61)
  Top 0.254: v14.22,94.61 14.87,93.97 | 14.87,93.97 15.24,93.6 16,93.6 22.73,86.87 S2.P$2 23.37,86.87 26.16,84.07 26.16,82.11 C25.1 | 14.87,93.97 14.09,94.26 v14.22,94.61 | 14.87,93.97 14.58,94.75 v14.22,94.61
  Bottom 0.254: STM.32 18.04,95.26 16.89,94.11 14.98,94.11 | 14.98,94.11 14.73,94.11 v14.22,94.61 | 14.98,94.11 14.16,94.24 v14.22,94.61 | 14.98,94.11 14.55,94.81 v14.22,94.61
GND  (via drill 0.61)
  Top 0.254: 6.6,122.97 C39.2 7.91,121.67 IC4.9 | 14.13,123.48 IC4.1 13.7,123.94 14.1,124.33 | IC4.11 10.3,120.63 10.29,120.65 9.65,120.65 9.27,120.27 9.27,119.15 | IC5.11 22.08,118.74 | 22.08,118.74 22.09,118.74 v22.73,119.38 | IC4.18 13.7,119.12 | 13.7,119.12 13.7,118.88 v14.22,118.36 | IC5.9 22.21,117.74 | 22.21,117.74 | 22.21,117.74 v22.86,117.09 | 9.27,119.15 9.27,119.13 v9.91,118.49 | 22.21,117.74 22.99,117.45 v22.86,117.09 | 22.21,117.74 22.5,116.96 v22.86,117.09 | 22.08,118.74 22.38,119.52 v22.73,119.38 | 22.08,118.74 22.86,119.02 v22.73,119.38 | 13.7,119.12 14.42,118.69 v14.22,118.36 | 13.7,119.12 13.85,118.3 v14.22,118.36 | 9.27,119.15 10.04,118.85 v9.91,118.49 | 9.27,119.15 9.55,118.37 v9.91,118.49
  Top 0.508: SDCARD2.6 8.01,105.78 | 8.01,105.78 8.75,105.78 | 8.01,105.78 8.75,106.26 v8.89,106.05 8.89,105.79 8.01,105.78
  Bottom 0.254: 20.54,98.97 20.32,99.19 | 20.32,99.19 19.94,99.57 19.94,99.82 v19.81,99.95 | v25.4,96.01 24.49,96.01 | 24.49,96.01 24.13,96.01 | v8.89,110.24 8.24,110.88 | 8.24,110.88 8.17,110.96 STM.74 | STM.10 21.95,106.96 | STM.26 STM.27 | STM.27 | STM.20 21.95,101.96 21.58,101.59 | 21.58,101.59 21.46,101.47 | STM.99 20.54,112.36 20.46,112.28 | 20.46,112.28 v19.81,111.63 | 21.58,101.59 20.95,101.06 v20.7,101.35 20.76,101.72 21.58,101.59 | 8.24,110.88 9.02,110.59 v8.89,110.24 | 8.24,110.88 8.53,110.1 v8.89,110.24 | 20.32,99.19 19.61,99.62 v19.81,99.95 | 20.32,99.19 20.19,100.01 v19.81,99.95 | 24.49,96.01 25.24,96.36 v25.4,96.01 | 24.49,96.01 25.24,95.67 v25.4,96.01 | STM.27 21.32,97.76 v21.46,97.41 21.29,97.07 STM.27 | 20.46,112.28 20.17,111.5 v19.81,111.63 | 20.46,112.28 19.68,111.99 v19.81,111.63 | 21.95,106.96 21.54,106.24 v21.21,106.43 21.14,106.8 21.95,106.96
  other vias: 21.21,107.82 16.89,110.24 19.81,110.24 18.42,110.24 16.89,111.63 18.42,111.63 24.89,113.41 22.86,121.79 6.35,121.67 10.41,110.24 11.94,110.24 26.04,121.16 14.22,123.95 6.35,120.02 19.69,107.82 13.97,111.63 8.89,108.84 8.89,107.44 10.03,102.11 11.43,102.11 15.49,103.63 15.49,105.16 24.89,111.89 24.38,116.97 15.49,118.36 19.05,101.09 6.99,95.89 21.34,94.87 4.7,118.24 23.11,97.41 8,94.74 15.37,110.24 15.37,111.63 19.69,103.63 21.21,105.03 21.21,103.63 18.03,106.43 18.03,103.63 18.03,105.03 18.03,107.82 8.89,104.65 8.13,118.49 12.83,102.11 14.22,102.11 14.48,107.82 14.48,106.43 13.08,108.97 9.91,103.5
  pour Bottom (isolate 0.508, rank 6, no thermals): -0.25,71.12 -0.25,80.01 24.64,80.01 24.64,90.93 -0.25,90.93 -0.25,125.6 40.13,125.6 40.13,71.12
  pour Top (isolate 0.508, rank 6, no thermals): 33.02,125.35 -12.83,125.35 -12.83,70.1 33.02,70.1
I2C1_SCL  (via drill 0.61)
  Top 0.254: IC4.23 | IC4.23 16.36,122.17 | 16.36,122.17 v17.27,122.17 | v17.27,122.17 | IC5.1 18.57,120.88 17.92,121.53 | 17.92,121.53 v17.27,122.17 | 16.36,122.17 17.11,122.52 v17.27,122.17 | 16.36,122.17 17.11,121.83 v17.27,122.17 | 17.92,121.53 17.14,121.82 v17.27,122.17 | 17.92,121.53 17.63,122.31 v17.27,122.17
  Bottom 0.254: STM.95 18.54,115.95 | 18.54,115.95 18.54,117.98 21.08,120.52 21.08,121.54 20.45,122.17 18.19,122.17 | R10.1 18.54,115.95 | v17.27,122.17 18.19,122.17 | 18.19,122.17 17.43,121.83 v17.27,122.17 | 18.19,122.17 17.43,122.52 v17.27,122.17
I2C1_SDA  (via drill 0.61)
  Top 0.254: IC4.24 14.99,122.68 15.37,123.06 18.14,123.06 | IC5.16 19.19,122.16 | 19.19,122.16 19.19,122.92 v19.05,123.06 | 18.14,123.06 v19.05,123.06 | 19.19,122.16 18.73,122.85 v19.05,123.06 | 19.19,122.16 19.42,122.96 v19.05,123.06 | 18.14,123.06 18.89,123.41 v19.05,123.06 | 18.14,123.06 18.89,122.72 v19.05,123.06
  Bottom 0.254: STM.96 19.04,115.95 | 19.04,115.95 19.04,117.72 21.59,120.27 21.59,121.79 20.32,123.06 19.96,123.06 | R11.1 19.04,115.95 | 19.96,123.06 v19.05,123.06 | 19.96,123.06 19.21,122.72 v19.05,123.06 | 19.96,123.06 19.21,123.41 v19.05,123.06
I2C2_SCL  (via drill 0.61)
  Top 0.254: 20.32,91.82 IC2.6 20.32,93.73 19.3,94.74 17.91,94.74 17.54,95.11 | R15.2 9.65,93.34 12.45,96.14 16.06,96.14 | 16.06,96.14 16.51,96.14 | 16.51,96.14 v16.89,95.76 | 17.54,95.11 v16.89,95.76 | 16.51,96.14 16.89,96.14 v16.89,95.76 | 16.06,96.14 16.6,95.51 v16.89,95.76 | 17.54,95.11 16.76,95.4 v16.89,95.76 | 17.54,95.11 17.25,95.89 v16.89,95.76
  Bottom 0.254: STM.47 10.54,96.52 10.92,96.14 16.06,96.14 | 16.06,96.14 16.51,96.14 | 16.51,96.14 v16.89,95.76 | 16.51,96.14 16.89,96.14 v16.89,95.76 | 16.06,96.14 16.6,95.51 v16.89,95.76
I2C2_SDA  (via drill 0.61)
  Top 0.254: IC2.5 19.05,94.11 16.64,94.11 16.27,94.48 | v15.62,95.12 16.27,94.48 | R16.1 11.68,94.61 12.7,95.63 14.86,95.63 | 14.86,95.63 15.11,95.63 v15.62,95.12 | 16.27,94.48 15.49,94.77 v15.62,95.12 | 16.27,94.48 15.98,95.26 v15.62,95.12 | 14.86,95.63 15.68,95.5 v15.62,95.12 | 14.86,95.63 15.3,94.92 v15.62,95.12
  Bottom 0.254: STM.48 10.04,96.26 10.67,95.63 14.86,95.63 | 14.86,95.63 15.11,95.63 v15.62,95.12 | 14.86,95.63 15.68,95.5 v15.62,95.12 | 14.86,95.63 15.3,94.92 v15.62,95.12
N$1
  Top 0.254: C1.1 25.65,105.64 Y1.2
  Bottom 0.254: STM.12 25.97,105.96 Y1.2
N$2
  Top 0.254: U$12.B+ 29.87,91.76 R2.1
N$3
  Top 0.254: IC4.10 8.57,121.13 C26.1
N$4  (via drill 0.61)
  Top 0.254: v24.13,76.96 25.04,76.96 | 25.04,76.96 28.17,76.96 | 28.17,76.96 v29.08,76.96 | v30.23,113.54 LD1.A | 25.04,76.96 24.29,76.62 v24.13,76.96 | 25.04,76.96 24.29,77.31 v24.13,76.96 | 28.17,76.96 28.92,77.31 v29.08,76.96 | 28.17,76.96 28.92,76.62 v29.08,76.96
  Bottom 0.254: v30.23,113.54 30.48,113.28 30.48,112.66 | 30.48,112.66 30.48,78.36 29.73,77.61 | 23.22,76.96 12.32,76.96 11.61,77.67 U1.31 | 23.22,76.96 v24.13,76.96 | v29.08,76.96 29.73,77.61 | 23.22,76.96 23.97,77.31 v24.13,76.96 | 23.22,76.96 23.97,76.62 v24.13,76.96 | 29.73,77.61 29.44,76.83 v29.08,76.96 | 29.73,77.61 28.95,77.32 v29.08,76.96 | 30.48,112.66 29.94,113.29 v30.23,113.54 | 30.48,112.66 30.6,113.48 v30.23,113.54
N$5
  Top 0.254: LD1.C R9.1
N$6
  Top 0.254: U$12.R+ 26.27,91.76 R6.1
N$7
  Top 0.254: U$12.G+ R3.1
N$8
  Top 0.254: IC4.20 16.02,120.63 C36.1
N$10
  Top 0.254: IC5.8 20.69,116.09 21.34,115.44 C27.1
N$11
  Top 0.254: LD2.C R1.1
N$12
  Top 0.254: IC5.10 23.98,118.24 C28.+
N$13
  Top 0.254: IC5.12 21.31,119.99 21.84,120.52 25.02,120.52 25.65,119.89 25.65,116.12 C27.2
N$27
  Bottom 0.254: R23.1 28.92,95 R25.2 28.92,92.46 28.96,92.42 R24.1
N$29
  Top 0.254: C20.1 28.04,103.91 Y1.1
  Bottom 0.254: STM.13 26.49,105.46 Y1.1
N$31  (via drill 0.61)
  Top 0.254: C17.1 5.45,110.24 | 5.45,110.24 4.83,110.24 v4.57,110.49 | 5.45,110.24 4.63,110.11 v4.57,110.49 | 5.45,110.24 4.82,110.78 v4.57,110.49
  Bottom 0.254: STM.73 5.49,110.46 | 5.49,110.46 4.6,110.46 v4.57,110.49 | 5.49,110.46 4.72,110.14 v4.57,110.49 | 5.49,110.46 4.74,110.83 v4.57,110.49
N$32
  Bottom 0.254: STM.49 9.54,95.43 C15.1
RGB_CH1  (via drill 0.61)
  Top 0.254: U$12.R- 26.27,98.19 v26.29,98.17
  Bottom 0.254: STM.23 21.97,100.46 21.72,100.2 21.72,99.19 22.35,98.55 25.46,98.55 | 25.46,98.55 25.91,98.55 | v26.29,98.17 25.91,98.55 | 25.91,98.55 26.29,98.55 v26.29,98.17 | 25.46,98.55 26,97.92 v26.29,98.17
RGB_CH2  (via drill 0.61)
  Top 0.254: v27.18,100.46 28.09,100.46 | 28.09,100.46 28.58,100.46 29.85,99.19 29.85,98.23 U$12.B- | 28.09,100.46 27.34,100.11 v27.18,100.46 | 28.09,100.46 27.34,100.8 v27.18,100.46
  Bottom 0.254: STM.24 23.99,99.96 24.38,99.57 25.91,99.57 26.37,100.03 | 26.37,100.03 26.8,100.46 v27.18,100.46 | 26.37,100.03 26.88,100.69 v27.18,100.46 | 26.37,100.03 27.2,100.08 v27.18,100.46
RGB_CH3  (via drill 0.61)
  Bottom 0.254: STM.25 23.44,99.06 27.22,99.06 27.42,98.86 | 27.42,98.86 U$12.G- | 27.42,98.86 28.2,98.57 U$12.G- | 27.42,98.86 27.71,98.08 U$12.G-
  other vias: 28.07,98.21
SDIO_CLK  (via drill 0.61)
  Top 0.254: SDCARD2.5 7.21,104.68 8.64,103.25 8.64,98.3 7.62,97.28 4.09,97.28 | v3.17,97.28 4.09,97.28 | 4.09,97.28 3.33,96.94 v3.17,97.28 | 4.09,97.28 3.33,97.63 v3.17,97.28
  Bottom 0.254: STM.80 11.04,114.69 10.54,115.19 4.06,115.19 1.52,112.65 1.52,98.93 2.53,97.93 | v3.17,97.28 2.53,97.93 | 2.53,97.93 3.31,97.64 v3.17,97.28 | 2.53,97.93 2.82,97.15 v3.17,97.28
SDIO_CMD  (via drill 0.61)
  Top 0.254: SDCARD2.3 2.79,102.48 1.4,103.88 1.4,110.11 2.41,111.12 2.41,114.44 | v2.67,115.32 2.41,115.06 2.41,114.44 | 2.41,114.44 2.29,115.26 v2.67,115.32 | 2.41,114.44 2.96,115.07 v2.67,115.32
  Bottom 0.254: STM.83 12.54,114.46 11.3,115.7 3.5,115.7 | 3.5,115.7 3.05,115.7 | 3.05,115.7 v2.67,115.32 | 3.5,115.7 2.96,115.07 v2.67,115.32 | 3.05,115.7 2.67,115.7 v2.67,115.32
SDIO_D0  (via drill 0.61)
  Top 0.254: SDCARD2.7 5.49,106.88 | 5.49,106.88 4.63,106.88 v4.57,106.93 | 5.49,106.88 4.71,106.58 v4.57,106.93 | 5.49,106.88 4.75,107.27 v4.57,106.93
  Bottom 0.254: STM.65 5.35,106.46 | 5.35,106.46 5.05,106.46 v4.57,106.93 | 5.35,106.46 4.53,106.56 v4.57,106.93 | 5.35,106.46 4.89,107.15 v4.57,106.93
SDIO_D1  (via drill 0.61)
  Top 0.254: SDCARD2.8 5.69,107.98 v5.33,108.33
  Bottom 0.254: STM.66 6.07,106.96 5.71,107.31 5.71,107.5 | 5.71,107.5 5.71,107.95 v5.33,108.33 | 5.71,107.5 5.08,108.04 v5.33,108.33 | 5.71,107.5 5.71,108.33 v5.33,108.33
SDIO_D2  (via drill 0.61)
  Top 0.254: SDCARD2.1 4.88,100.28 4.33,100.83 | 4.33,100.83 v3.68,101.47 | 4.33,100.83 3.55,101.12 v3.68,101.47 | 4.33,100.83 4.04,101.61 v3.68,101.47
  Bottom 0.254: STM.78 10.04,112.4 9.65,112.01 8.51,112.01 7.24,113.28 4.45,113.28 3.05,111.89 3.05,102.13 | 3.05,102.13 3.05,102.11 v3.68,101.47 | 3.05,102.13 3.82,101.83 v3.68,101.47 | 3.05,102.13 3.32,101.35 v3.68,101.47
SDIO_D3  (via drill 0.61)
  Top 0.254: SDCARD2.2 6.7,101.38 7.24,100.84 7.24,99.82 6.73,99.31 3.96,99.31 | 3.96,99.31 v3.05,99.31 | 3.96,99.31 3.21,98.97 v3.05,99.31 | 3.96,99.31 3.21,99.66 v3.05,99.31
  Bottom 0.254: STM.79 10.54,114.43 10.29,114.68 4.32,114.68 2.03,112.4 2.03,100.33 2.4,99.96 | v3.05,99.31 2.4,99.96 | 2.4,99.96 3.18,99.67 v3.05,99.31 | 2.4,99.96 2.69,99.18 v3.05,99.31
SDIO_DETECT  (via drill 0.61)
  Top 0.254: v16,101.35 16.13,101.47 SDCARD2.CD2
  Bottom 0.254: STM.54 15.17,100.96 | 15.17,100.96 15.61,100.96 v16,101.35 | 15.17,100.96 15.71,101.59 v16,101.35 | 15.17,100.96 16.01,100.97 v16,101.35
SW-!RESET
  Top 0.254: 1.52,79.69 1.52,77.85 7.24,72.14 18.92,72.14 JP4.5 | 1.52,79.69 S1.P$2 | 1.52,79.69 C13.1
  Bottom 0.254: STM.14 24.96,104.96 29.97,99.95 29.97,79.63 24.38,74.04 JP4.5
SW_CLK
  Bottom 0.254: STM.76 8.58,113.92 4.32,113.92 2.54,112.14 2.54,101.22 4.19,99.57 4.19,94.23 5.46,92.96 5.46,75.95 9.27,72.14 16.38,72.14 JP4.4
SW_DIO
  Bottom 0.254: STM.72 5.56,109.96 3.56,107.95 3.56,103.63 4.7,102.49 4.7,94.49 5.97,93.22 5.97,77.72 7.87,75.82 11.43,75.82 JP4.2
USART3_RX
  Bottom 0.254: STM.56 5.69,101.96 5.21,101.47 5.21,94.87 7.11,92.96 U1.1
USART3_TX
  Bottom 0.254: STM.55 5.95,101.46 5.71,101.22 5.71,95.38 8.61,92.48 U1.2

### Text on the board
tNames: SENSE V2 | vnd241092 | Y | X